# EAGLE design spi2par2019faithful (EAGLE 9.3.0)
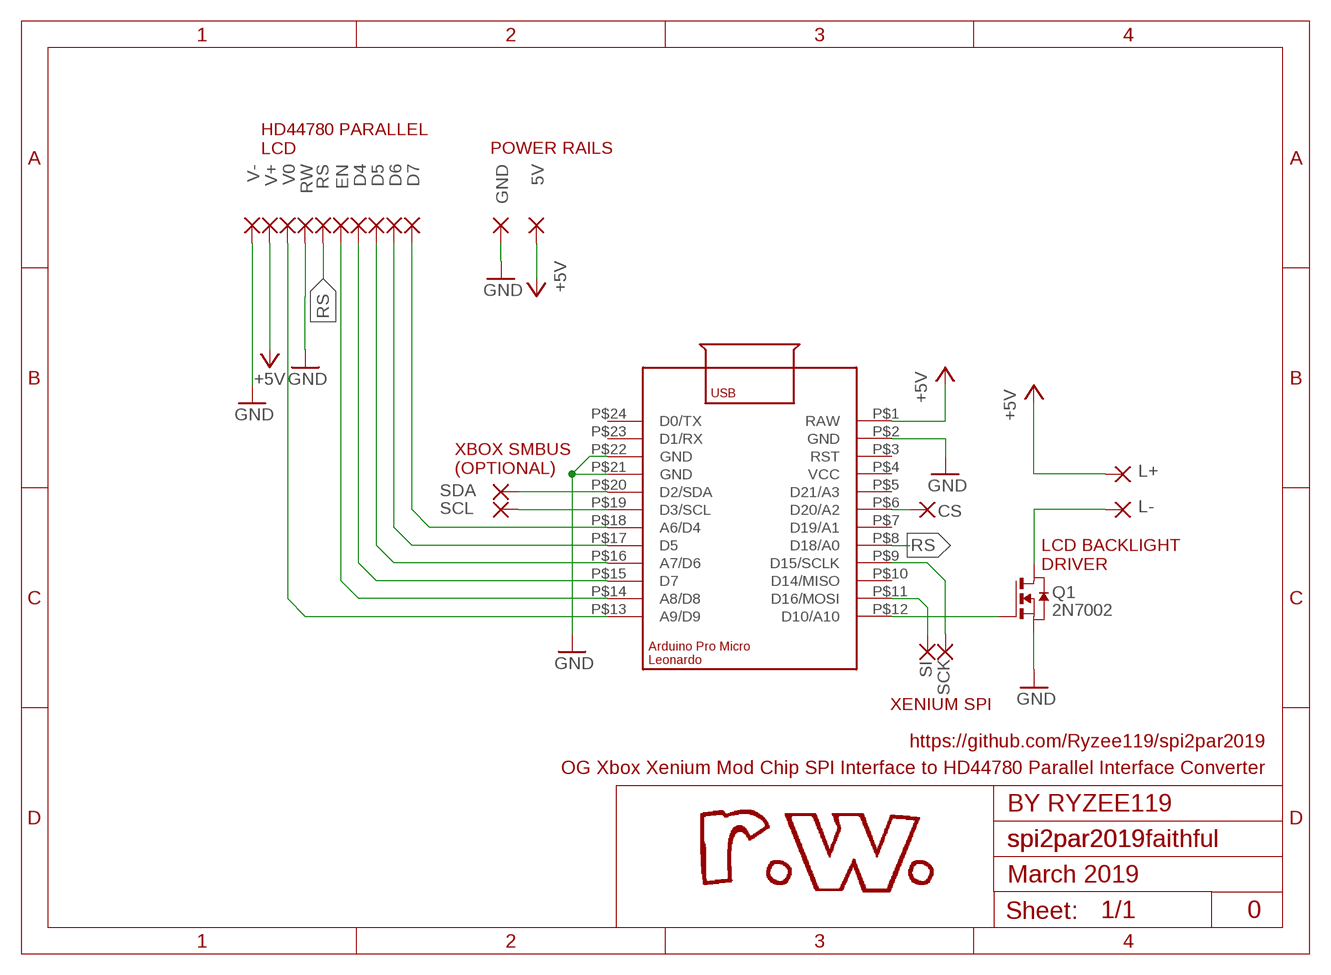
[diagram p0: schematic, sheet 1]

## Parts
5V  WIREPADSMD1,27-254  [SMD1,27-2,54]
CS  WIREPADSMD1,27-254  [SMD1,27-2,54]
D4  WIREPADSMD1,27-254  [SMD1,27-2,54]
D5  WIREPADSMD1,27-254  [SMD1,27-2,54]
D6  WIREPADSMD1,27-254  [SMD1,27-2,54]
D7  WIREPADSMD1,27-254  [SMD1,27-2,54]
EN  WIREPADSMD1,27-254  [SMD1,27-2,54]
GND  WIREPADSMD1,27-254  [SMD1,27-2,54]
L+  WIREPADSMD1,27-254  [SMD1,27-2,54]
L-  WIREPADSMD1,27-254  [SMD1,27-2,54]
Q1  2N70026Ω  NMOSSOT23  [SOT-23]
RS  WIREPADSMD1,27-254  [SMD1,27-2,54]
RW  WIREPADSMD1,27-254  [SMD1,27-2,54]
SCK  WIREPADSMD1,27-254  [SMD1,27-2,54]
SCL  WIREPADSMD1,27-254  [SMD1,27-2,54]
SDA  WIREPADSMD1,27-254  [SMD1,27-2,54]
SI  WIREPADSMD1,27-254  [SMD1,27-2,54]
U1  ARDUINO_LEONARDO_MICRO  [ARDUINO_LEONARDO_MICRO]
V0  WIREPADSMD1,27-254  [SMD1,27-2,54]
V+  WIREPADSMD1,27-254  [SMD1,27-2,54]
V-  WIREPADSMD1,27-254  [SMD1,27-2,54]

## Nets
+5V: 5V.1(P) L+.1(P) U1.P$1(RAW) V+.1(P)
GND: GND.1(P) Q1.2(S) RW.1(P) U1.P$2(GND) U1.P$21(GND) U1.P$22(GND) V-.1(P)
N$1: SCL.1(P) U1.P$19(D3/SCL)
N$2: CS.1(P) U1.P$6(D20/A2)
N$3: SCK.1(P) U1.P$9(D15/SCLK)
N$4: SI.1(P) U1.P$11(D16/MOSI)
N$5: D7.1(P) U1.P$18(A6/D4)
N$6: D6.1(P) U1.P$17(D5)
N$7: D5.1(P) U1.P$16(A7/D6)
N$8: D4.1(P) U1.P$15(D7)
N$9: EN.1(P) U1.P$14(A8/D8)
N$11: Q1.3(G) U1.P$12(D10/A10)
N$12: U1.P$13(A9/D9) V0.1(P)
N$13: L-.1(P) Q1.1(D)
N$14: SDA.1(P) U1.P$20(D2/SDA)
RS: RS.1(P) U1.P$8(D18/A0)
Unconnected: U1.P$3(RST) U1.P$4(VCC) U1.P$5(D21/A3) U1.P$7(D19/A1) U1.P$10(D14/MISO) U1.P$23(D1/RX) U1.P$24(D0/TX)

## Notes on the sheet
- HD44780 PARALLEL
  LCD
- POWER RAILS
- XBOX SMBUS
  (OPTIONAL)
- LCD BACKLIGHT
  DRIVER
- 2N7002
- XENIUM SPI
- https://github.com/Ryzee119/spi2par2019
- OG Xbox Xenium Mod Chip SPI Interface to HD44780 Parallel Interface Converter
- BY RYZEE119
- spi2par2019
- March 2019
- 0

## Library data of the parts
5V CS D4-D7 EN GND L+ L- RS RW SCK SCL SDA SI V0 V+ V- = wirepad:WIREPAD: Wire PAD connect wire on PCB
Q1 = zetex:NMOSSOT23: MOS FET; OC_FARNELL: unknown; OC_NEWARK: unknown
U1 = my-library:ARDUINO_LEONARDO_MICRO

## Board
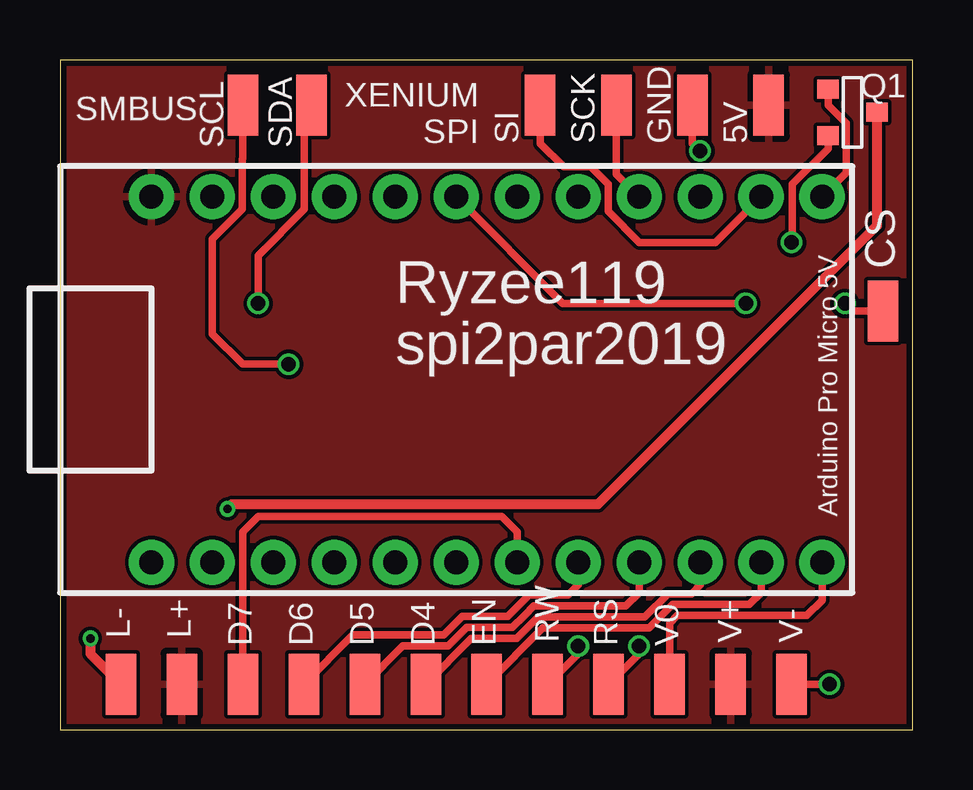
[diagram p1: board, top side]
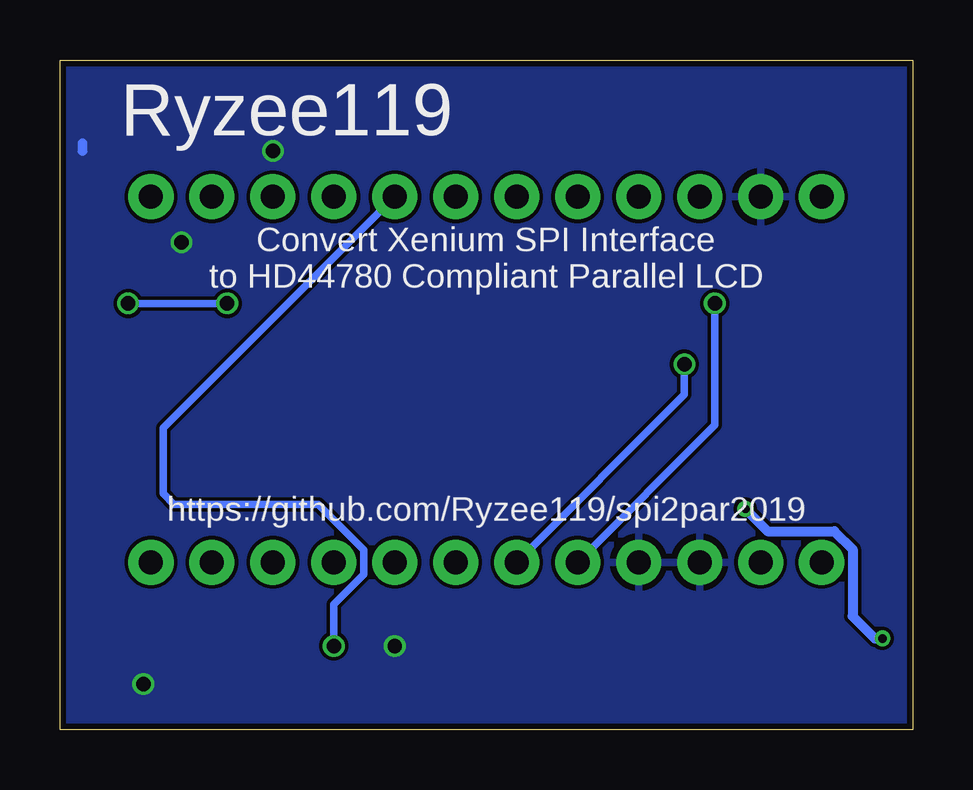
[diagram p2: board, bottom side, seen from below]

Size 35.54 x 27.93 mm. Coordinates in mm from the lower left corner, seen from the top.
Outline: 0,0 35.54,0 35.54,27.93 0,27.93 0,0
Copper layers (1*16): Top 0.035mm / dielectric 1.5mm / Bottom 0.035mm
Design rules "Elecrow_2-layer_eagle_rule": minimum track width 6mil, minimum drill 12mil, track to track 6mil, track to pad 6mil, pad to pad 6mil, via to via 6mil, smd to smd 0mil, copper to edge 10mil, drill to drill 10mil, minimum pad ring 10mil, minimum via ring 6mil, stop-mask expansion 2mil, vias tented up to drill 100mil, thermal gap 10mil

### Footprints (pad centres in the part's own frame; a part is rotated, then mirrored left to right if it is on the bottom)
SMD1,27-2,54 = smd 1.27 x 2.54: 1 0,0
SOT-23 = smd 0.787 x 0.889: 1 0.025,-1.016; 2 -0.94,1.016; 3 0.991,1.016
ARDUINO_LEONARDO_MICRO = drill 1 pad 1.88: P$1 16.51,29.21; P$2 16.51,26.67; P$3 16.51,24.13; P$4 16.51,21.59; P$5 16.51,19.05; P$6 16.51,16.51; P$7 16.51,13.97; P$8 16.51,11.43; P$9 16.51,8.89; P$10 16.51,6.35; P$11 16.51,3.81; P$12 16.51,1.27; P$13 1.27,1.27; P$14 1.27,3.81; P$15 1.27,6.35; P$16 1.27,8.89; P$17 1.27,11.43; P$18 1.27,13.97; P$19 1.27,16.51; P$20 1.27,19.05; P$21 1.27,21.59; P$22 1.27,24.13; P$23 1.27,26.67; P$24 1.27,29.21

### Placement (x,y rotation side)
5V  29.53,26.04 180 top
CS  34.29,17.46 0 top
D4  15.24,1.91 0 top
D5  12.7,1.91 0 top
D6  10.16,1.91 0 top
D7  7.62,1.91 0 top
EN  17.78,1.91 0 top
GND  26.35,26.04 180 top
L+  5.08,1.91 180 top
L-  2.54,1.91 0 top
Q1  33.02,25.72 90 top
RS  22.86,1.91 0 top
RW  20.32,1.91 0 top
SCK  23.18,26.04 180 top
SCL  7.62,26.04 0 top
SDA  10.48,26.04 0 top
SI  20,26.04 180 top
U1  33.02,5.71 90 top
V0  25.4,1.91 0 top
V+  27.94,1.91 0 top
V-  30.48,1.91 0 top

### Tracks (layer width: path | path; a pad name or v marks a point on that pad's centre or on a via)
+5V
  pour Top: -5.08,1.27 -5.08,31.75 43.18,31.75 43.18,-5.08 -5.08,-5.08
GND  (via drill 0.6)
  Top 0.305: V-.1 v32.07,1.91 | RW.1 21.59,3.17 v21.59,3.49 | Q1.2 32,24.24 30.5,22.74 30.5,20.34 v30.48,20.32 | GND.1 26.35,24.45 v26.67,24.13
  Bottom 0.406: 34.61,24.45 34.61,24.13
  pour Bottom: -6.35,7.62 -6.35,33.02 44.45,33.02 44.45,-6.35 -6.35,-6.35
N$1  (via drill 0.6)
  Top 0.305: v9.53,15.24 7.62,15.24 6.35,16.51 6.35,20.46 7.59,21.71 7.59,23.79 7.62,23.81 SCL.1
  Bottom 0.305: U1.P$19 9.53,13.97 v9.53,15.24
N$2  (via drill 0.6)
  Top 0.305: U1.P$6 20.95,17.78 v28.57,17.78 | v32.7,17.78 33.02,17.46 CS.1
  Bottom 0.305: v28.57,17.78 v32.7,17.78
N$3
  Top 0.305: U1.P$9 23.18,23.18 SCK.1
N$4
  Top 0.305: U1.P$11 27.3,20.32 24.13,20.32 22.84,21.61 22.84,22.74 22.11,23.47 20.98,23.47 20,24.45 SI.1
N$5
  Top 0.305: D7.1 7.62,8.26 8.26,8.89 18.41,8.89 19.05,8.26 U1.P$18
N$6
  Top 0.305: U1.P$17 21.59,6.03 21.18,5.62 19.56,5.62 18.66,4.72 16.77,4.72 15.99,3.95 12.21,3.95 D6.1
N$7
  Top 0.305: D5.1 14.29,3.49 16.18,3.49 16.96,4.27 18.85,4.27 19.36,4.77 | 19.36,4.77 19.75,5.16 | 19.36,4.77 19.75,5.16 | U1.P$16 24.13,5.71 23.58,5.16 19.75,5.16
N$8
  Top 0.305: D4.1 17.14,3.81 19.04,3.81 19.93,4.71 24.37,4.71 25.34,5.68 26.31,5.68 26.67,6.03 U1.P$15
N$9
  Top 0.305: EN.1 20.12,4.25 24.56,4.25 25.53,5.22 28.71,5.22 29.21,5.71 U1.P$14
N$11
  Top 0.305: Q1.3 32,26.05 32.75,25.3 32.75,23.23 U1.P$12
N$12
  Top 0.305: V0.1 25.4,4.45 25.72,4.76 31.11,4.76 31.75,5.4 U1.P$13
N$13  (via drill 0.35)
  Top 0.406: v6.99,9.21 7.18,9.4 20.75,9.4 22.42,9.4 34.04,21.02 Q1.1 | v1.27,3.81 1.27,3.17 L-.1
  Bottom 0.406: v1.27,3.81 1.59,3.81 2.51,4.74 2.51,7.52 3.27,8.28 6.06,8.28 v6.99,9.21
N$14  (via drill 0.6)
  Top 0.305: SDA.1 10.19,25.74 10.19,21.71 8.26,19.78 v8.26,17.78
  Bottom 0.305: U1.P$20 8.26,12.7 v8.26,17.78
RS  (via drill 0.6)
  Top 0.305: RS.1 24.13,3.17 v24.13,3.49
  Bottom 0.305: v24.13,3.49 24.13,5.22 22.89,6.47 22.89,7.5 24.79,9.4 30.79,9.4 31.24,9.85 31.24,12.58 U1.P$8

### Text on the board
tPlace: SMBUS | XENIUM / SPI | Ryzee119 | spi2par2019
bPlace: Ryzee119 | Convert Xenium SPI Interface / to HD44780 Compliant Parallel LCD | https://github.com/Ryzee119/spi2par2019